# EAGLE design M705D (EAGLE 6.6.0)
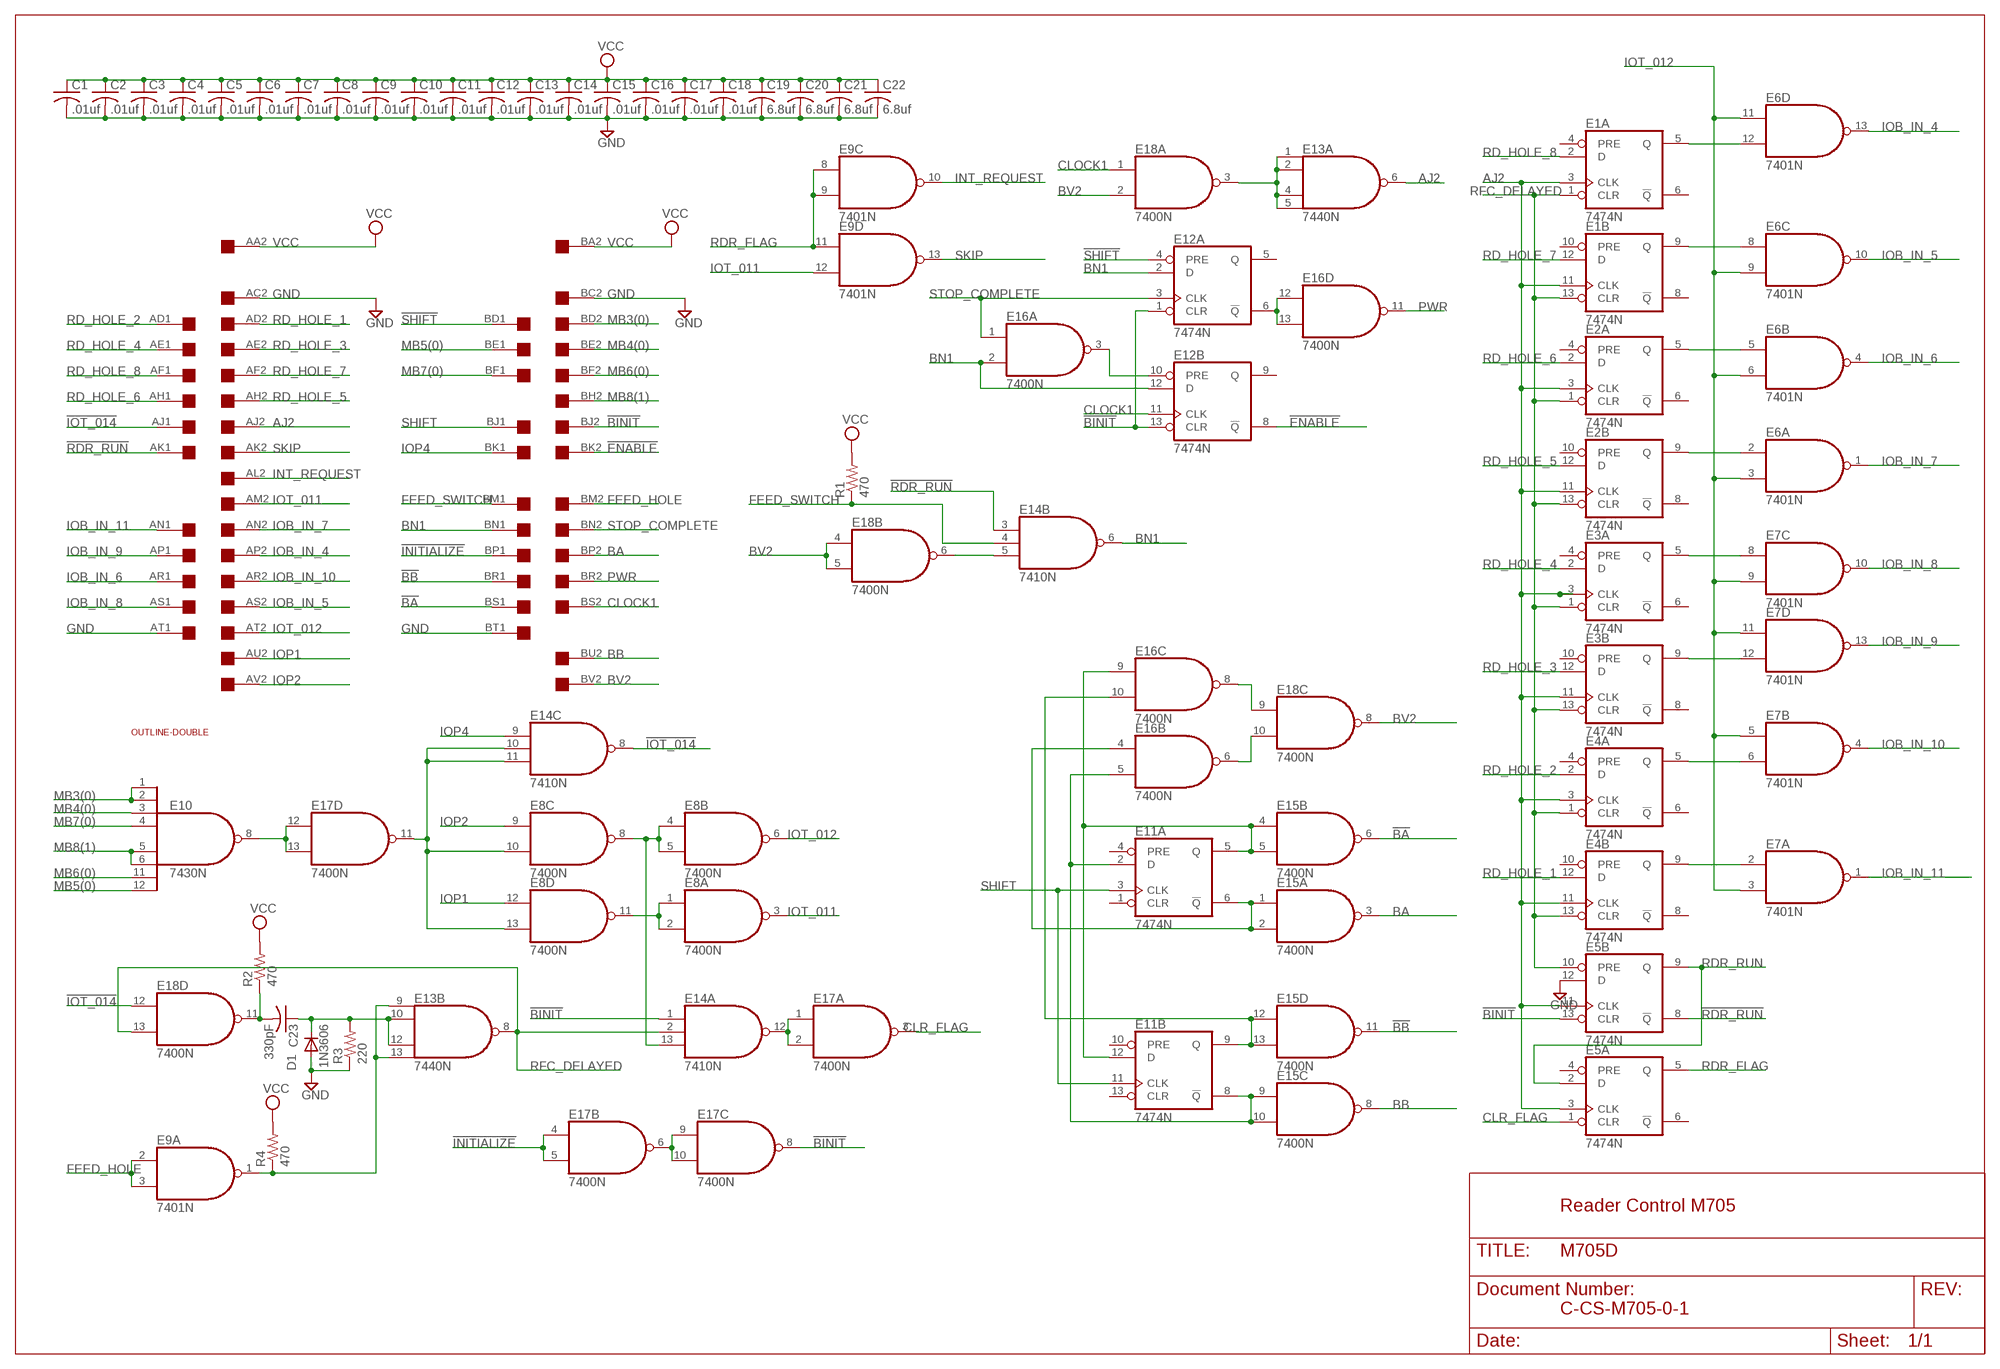
[diagram p0: schematic, sheet 1]

## Parts
C1  .01uf  C-US075-032X103  [C075-032X103]
C2  .01uf  C-US075-032X103  [C075-032X103]
C3  .01uf  C-US075-032X103  [C075-032X103]
C4  .01uf  C-US075-032X103  [C075-032X103]
C5  .01uf  C-US075-032X103  [C075-032X103]
C6  .01uf  C-US075-032X103  [C075-032X103]
C7  .01uf  C-US075-032X103  [C075-032X103]
C8  .01uf  C-US075-032X103  [C075-032X103]
C9  .01uf  C-US075-032X103  [C075-032X103]
C10  .01uf  C-US075-032X103  [C075-032X103]
C11  .01uf  C-US075-032X103  [C075-032X103]
C12  .01uf  C-US075-032X103  [C075-032X103]
C13  .01uf  C-US075-032X103  [C075-032X103]
C14  .01uf  C-US075-032X103  [C075-032X103]
C15  .01uf  C-US075-032X103  [C075-032X103]
C16  .01uf  C-US075-032X103  [C075-032X103]
C17  .01uf  C-US075-032X103  [C075-032X103]
C18  .01uf  C-US075-032X103  [C075-032X103]
C19  6.8uf  C-US150-054X183  [C150-054X183]
C20  6.8uf  C-US150-054X183  [C150-054X183]
C21  6.8uf  C-US150-054X183  [C150-054X183]
C22  6.8uf  C-US150-054X183  [C150-054X183]
C23  330pF  C-US075-032X103  [C075-032X103]
D1  1N3606  1N4148DO35-10  [DO35-10]
E1  7474N  74S74N  [DIL14]
E2  7474N  74S74N  [DIL14]
E3  7474N  74S74N  [DIL14]
E4  7474N  74S74N  [DIL14]
E5  7474N  74S74N  [DIL14]
E6  7401N  74LS01N  [DIL14]
E7  7401N  74LS01N  [DIL14]
E8  7400N  [DIL14]
E9  7401N  74LS01N  [DIL14]
E10  7430N  [DIL14]
E11  7474N  74S74N  [DIL14]
E12  7474N  74S74N  [DIL14]
E13  7440N  74S20N  [DIL14]
E14  7410N  [DIL14]
E15  7400N  [DIL14]
E16  7400N  [DIL14]
E17  7400N  [DIL14]
E18  7400N  [DIL14]
R1  470  R-US_0207/10  [0207/10]
R2  470  R-US_0207/10  [0207/10]
R3  220  R-US_0207/10  [0207/10]
R4  470  R-US_0207/10  [0207/10]
U$5  DOUBLE  [EDGE-CON4]
U$6  OUTLINE-DOUBLE  [DOUBLE]

## Nets
!BA: E15.6(B:O) U$5.BS1
!BB: E15.11(D:O) U$5.BR1
!BINIT: E5.13(B:CLR) E12.1(A:CLR) E12.13(B:CLR) E14.1(A:I0) E17.8(C:O) U$5.BJ2
!ENABLE: E12.8(B:!Q) U$5.BK2
!INITIALIZE: E17.4(B:I0) E17.5(B:I1) U$5.BP1
!IOT_014: E14.8(C:O) E18.12(D:I0) U$5.AJ1
!RDR_RUN: E5.8(B:!Q) E14.3(B:I0) U$5.AK1
!SHIFT: E12.4(A:PRE) U$5.BD1
AJ2: E1.3(A:CLK) E1.11(B:CLK) E2.3(A:CLK) E2.11(B:CLK) E3.3(A:CLK) E3.11(B:CLK) E4.3(A:CLK) E4.11(B:CLK) E5.3(A:CLK) E5.11(B:CLK) E13.6(A:O) U$5.AJ2
BA: E15.3(A:O) U$5.BP2
BB: E15.8(C:O) U$5.BU2
BN1: E12.2(A:D) E12.12(B:D) E14.6(B:O) E16.2(A:I1) U$5.BN1
BV2: E18.2(A:I1) E18.4(B:I0) E18.5(B:I1) E18.8(C:O) U$5.BV2
CLOCK1: E12.11(B:CLK) E18.1(A:I0) U$5.BS2
CLR_FLAG: E5.1(A:CLR) E17.3(A:O)
FEED_HOLE: E9.2(A:I0) E9.3(A:I1) U$5.BM2
FEED_SWITCH: E14.4(B:I1) R1.1 U$5.BM1
GND [Supply]: C1.2 C2.2 C3.2 C4.2 C5.2 C6.2 C7.2 C8.2 C9.2 C10.2 C11.2 C12.2 C13.2 C14.2 C15.2 C16.2 C17.2 C18.2 C19.2 C20.2 C21.2 C22.2 D1.A E5.12(B:D) R3.1 U$5.AC2 U$5.AT1 U$5.BC2 U$5.BT1
INT_REQUEST: E9.10(C:O) U$5.AL2
IOB_IN_4: E6.13(D:O) U$5.AP2
IOB_IN_5: E6.10(C:O) U$5.AS2
IOB_IN_6: E6.4(B:O) U$5.AR1
IOB_IN_7: E6.1(A:O) U$5.AN2
IOB_IN_8: E7.10(C:O) U$5.AS1
IOB_IN_9: E7.13(D:O) U$5.AP1
IOB_IN_10: E7.4(B:O) U$5.AR2
IOB_IN_11: E7.1(A:O) U$5.AN1
IOP1: E8.12(D:I0) U$5.AU2
IOP2: E8.9(C:I0) U$5.AV2
IOP4: E14.9(C:I0) U$5.BK1
IOT_011: E8.3(A:O) E9.12(D:I1) U$5.AM2
IOT_012: E6.3(A:I1) E6.6(B:I1) E6.9(C:I1) E6.11(D:I0) E7.3(A:I1) E7.5(B:I0) E7.9(C:I1) E7.11(D:I0) E8.6(B:O) U$5.AT2
MB3(0): E10.1(I0) E10.2(I1) U$5.BD2
MB4(0): E10.3(I2) U$5.BE2
MB5(0): E10.12(I7) U$5.BE1
MB6(0): E10.11(I6) U$5.BF2
MB7(0): E10.4(I3) U$5.BF1
MB8(1): E10.5(I4) E10.6(I5) U$5.BH2
N$1: E11.9(B:Q) E15.12(D:I0) E15.13(D:I1) E16.10(C:I1)
N$2: E1.5(A:Q) E6.12(D:I1)
N$3: E1.9(B:Q) E6.8(C:I0)
N$4: E11.6(A:!Q) E15.1(A:I0) E15.2(A:I1) E16.4(B:I0)
N$5: E10.8(O) E17.12(D:I0) E17.13(D:I1)
N$6: E8.4(B:I0) E8.5(B:I1) E8.8(C:O) E14.13(A:I2)
N$7: E8.1(A:I0) E8.2(A:I1) E8.11(D:O)
N$8: E8.10(C:I1) E8.13(D:I1) E14.10(C:I1) E14.11(C:I2) E17.11(D:O)
N$9: E2.5(A:Q) E6.5(B:I0)
N$10: E2.9(B:Q) E6.2(A:I0)
N$11: E3.5(A:Q) E7.8(C:I0)
N$12: E3.9(B:Q) E7.12(D:I1)
N$13: E4.5(A:Q) E7.6(B:I1)
N$14: E4.9(B:Q) E7.2(A:I0)
N$15: E11.2(A:D) E11.8(B:!Q) E15.9(C:I0) E15.10(C:I1) E16.5(B:I1)
N$23: E11.5(A:Q) E11.12(B:D) E15.4(B:I0) E15.5(B:I1) E16.9(C:I0)
N$24: E16.8(C:O) E18.9(C:I0)
N$25: E16.6(B:O) E18.10(C:I1)
N$26: E13.1(A:I0) E13.2(A:I1) E13.4(A:I2) E13.5(A:I3) E18.3(A:O)
N$27: E12.6(A:!Q) E16.12(D:I0) E16.13(D:I1)
N$28: E12.10(B:PRE) E16.3(A:O)
N$29: C23.2 E18.11(D:O) R2.1
N$30: C23.1 D1.C E13.10(B:I1) E13.12(B:I2) R3.2
N$31: E9.1(A:O) E13.9(B:I0) E13.13(B:I3) R4.1
N$32: E17.6(B:O) E17.9(C:I0) E17.10(C:I1)
N$33: E14.12(A:O) E17.1(A:I0) E17.2(A:I1)
N$34: E14.5(B:I2) E18.6(B:O)
PWR: E16.11(D:O) U$5.BR2
RD_HOLE_1: E4.12(B:D) U$5.AD2
RD_HOLE_2: E4.2(A:D) U$5.AD1
RD_HOLE_3: E3.12(B:D) U$5.AE2
RD_HOLE_4: E3.2(A:D) U$5.AE1
RD_HOLE_5: E2.12(B:D) U$5.AH2
RD_HOLE_6: E2.2(A:D) U$5.AH1
RD_HOLE_7: E1.12(B:D) U$5.AF2
RD_HOLE_8: E1.2(A:D) U$5.AF1
RDR_FLAG: E5.5(A:Q) E9.8(C:I0) E9.9(C:I1) E9.11(D:I0)
RDR_RUN: E5.2(A:D) E5.9(B:Q)
RFC_DELAYED: E1.1(A:CLR) E1.13(B:CLR) E2.1(A:CLR) E2.13(B:CLR) E3.1(A:CLR) E3.13(B:CLR) E4.1(A:CLR) E4.13(B:CLR) E5.10(B:PRE) E13.8(B:O) E14.2(A:I1) E18.13(D:I1)
SHIFT: E11.3(A:CLK) E11.11(B:CLK) U$5.BJ1
SKIP: E9.13(D:O) U$5.AK2
STOP_COMPLETE: E12.3(A:CLK) E16.1(A:I0) U$5.BN2
VCC [Supply]: C1.1 C2.1 C3.1 C4.1 C5.1 C6.1 C7.1 C8.1 C9.1 C10.1 C11.1 C12.1 C13.1 C14.1 C15.1 C16.1 C17.1 C18.1 C19.1 C20.1 C21.1 C22.1 R1.2 R2.2 R4.2 U$5.AA2 U$5.BA2
Unconnected: E1.4(A:PRE) E1.6(A:!Q) E1.8(B:!Q) E1.10(B:PRE) E2.4(A:PRE) E2.6(A:!Q) E2.8(B:!Q) E2.10(B:PRE) E3.4(A:PRE) E3.6(A:!Q) E3.8(B:!Q) E3.10(B:PRE) E4.4(A:PRE) E4.6(A:!Q) E4.8(B:!Q) E4.10(B:PRE) E5.4(A:PRE) E5.6(A:!Q) E9.4(B:O) E9.5(B:I0) E9.6(B:I1) E11.1(A:CLR) E11.4(A:PRE) E11.10(B:PRE) E11.13(B:CLR) E12.5(A:Q) E12.9(B:Q) U$5.AA1 U$5.AB1 U$5.AB2 U$5.AC1 U$5.AL1 U$5.AM1 U$5.AU1 U$5.AV1 U$5.BA1 U$5.BB1 U$5.BB2 U$5.BC1 U$5.BH1 U$5.BL1 U$5.BL2 U$5.BT2 U$5.BU1 U$5.BV1

## Notes on the sheet
- Reader Control M705
- C-CS-M705-0-1

## Power pins joined to a net without a drawn wire
GND: E1.7(P:GND) E2.7(P:GND) E3.7(P:GND) E4.7(P:GND) E5.7(P:GND) E6.7(P:GND) E7.7(P:GND) E8.7(P:GND) E9.7(P:GND) E10.7(GND) E11.7(P:GND) E12.7(P:GND) E13.7(P:GND) E14.7(P:GND) E15.7(P:GND) E16.7(P:GND) E17.7(P:GND) E18.7(P:GND)
VCC: E1.14(P:VCC) E2.14(P:VCC) E3.14(P:VCC) E4.14(P:VCC) E5.14(P:VCC) E6.14(P:VCC) E7.14(P:VCC) E8.14(P:VCC) E9.14(P:VCC) E10.14(VCC) E11.14(P:VCC) E12.14(P:VCC) E13.14(P:VCC) E14.14(P:VCC) E15.14(P:VCC) E16.14(P:VCC) E17.14(P:VCC) E18.14(P:VCC)

## Library data of the parts
C1-C23 = rcl:C-US: CAPACITOR, American symbol
D1 = diode:1N4148: DIODE high speed (Philips)
E1-E5 E11 E12 = 74xx-us:74*74: Dual D type positive edge triggered FLIP FLOP, preset and clear
E6 E7 E9 = 74xx-us:74*01: Quad 2-input NAND gate, open collector
E8 E15-E18 = 74xx-us:74*00: Quad 2-input NAND gate
E10 = 74xx-us:74*30: 8-input NAND gate
E13 = 74xx-us:74*20: Dual 4-input NAND gate
E14 = 74xx-us:74*10: Triple 3-input NAND gate
R1-R4 = rcl:R-US_: RESISTOR, American symbol
U$5 = dec-con:DOUBLE: Double-Height DEC board
U$6 = dec-con:OUTLINE-*: Board outlines for DEC boards.

## Net classes
1 Supply: width 0.813 mm

## Board
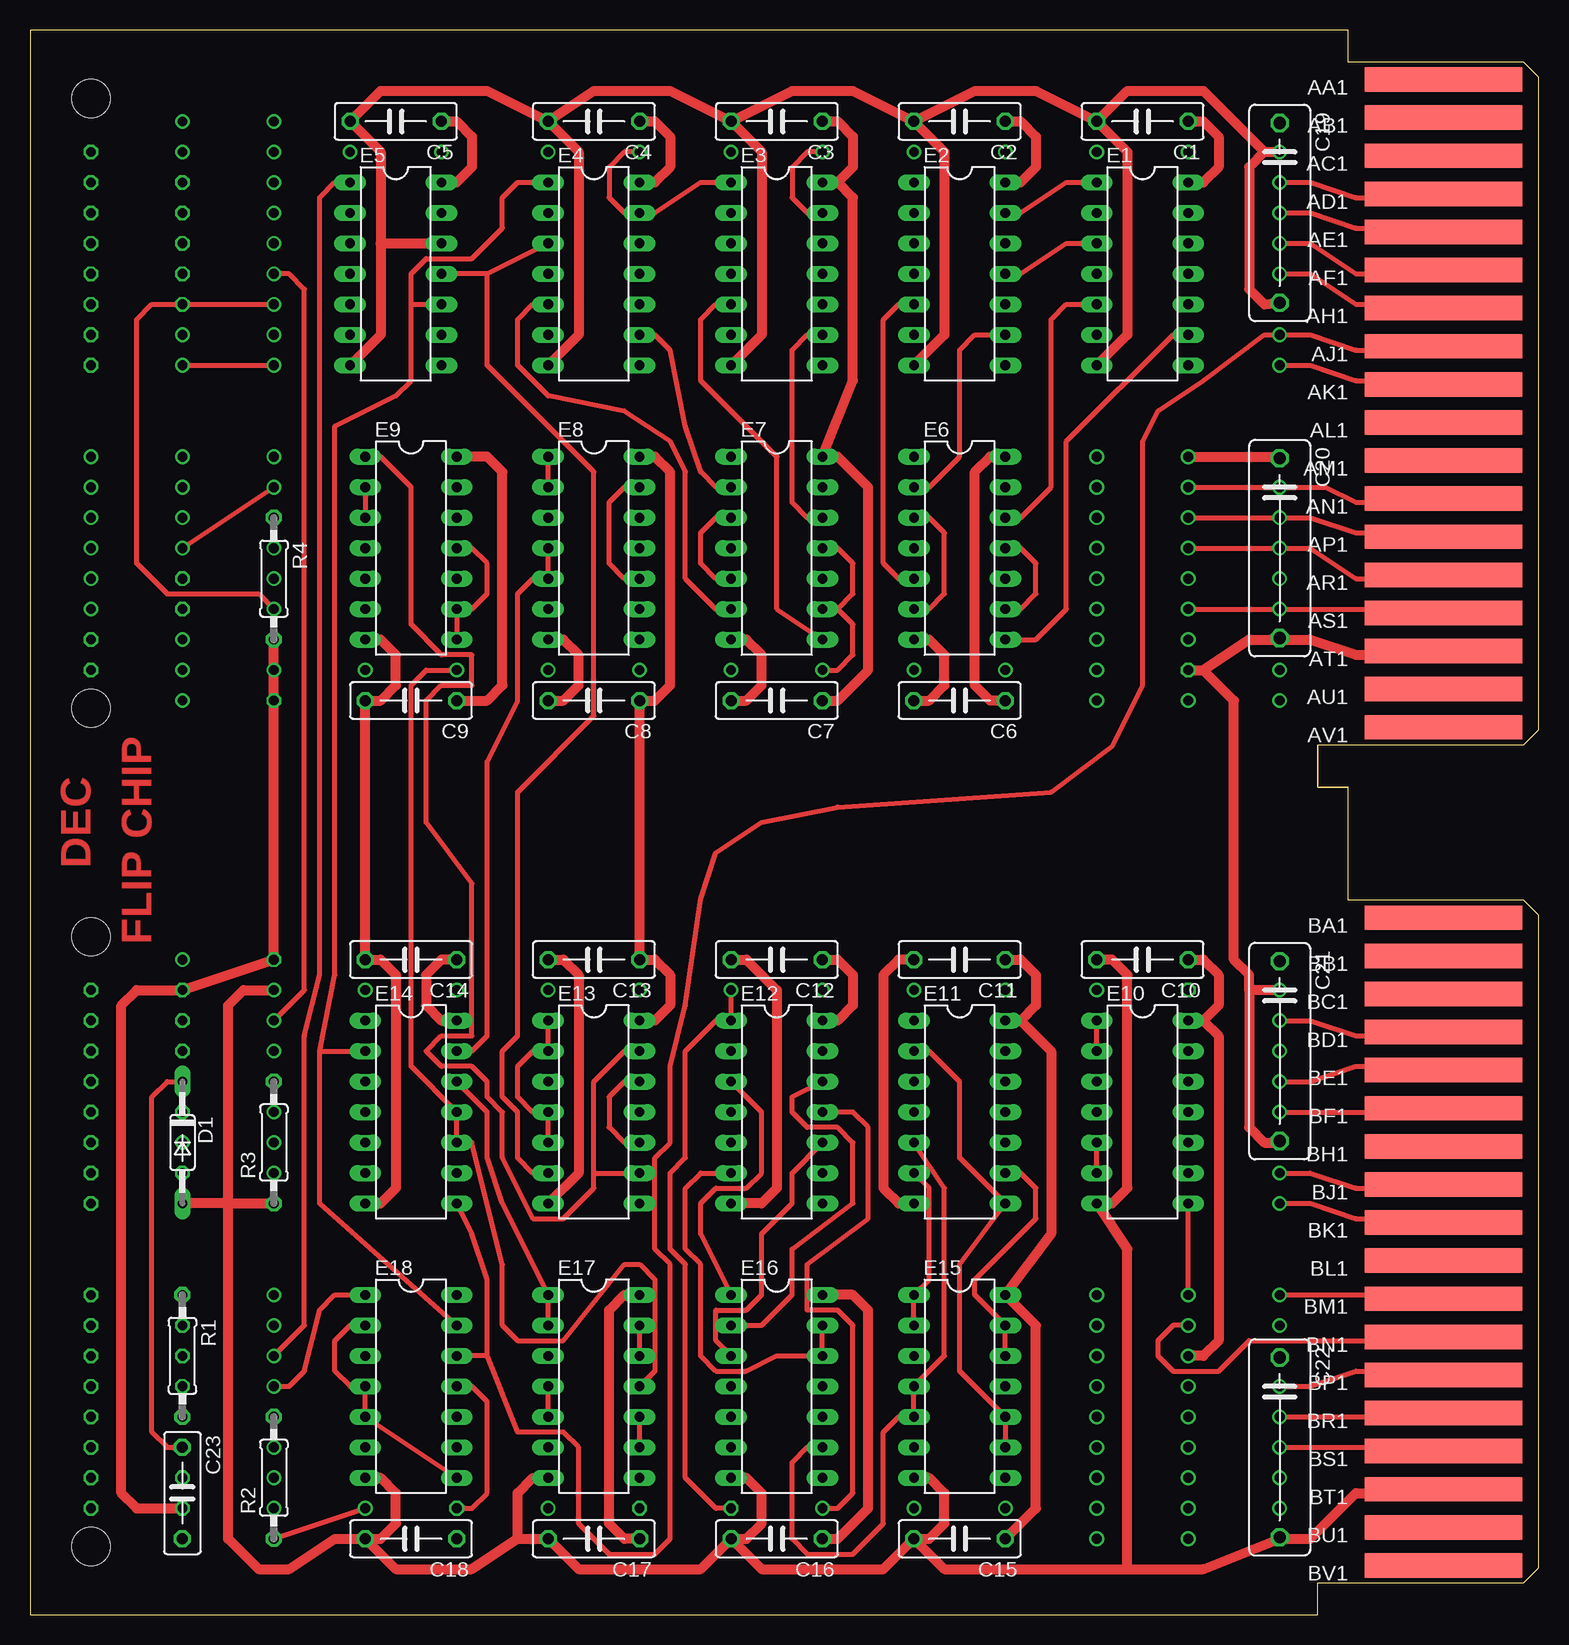
[diagram p1: board, top side]
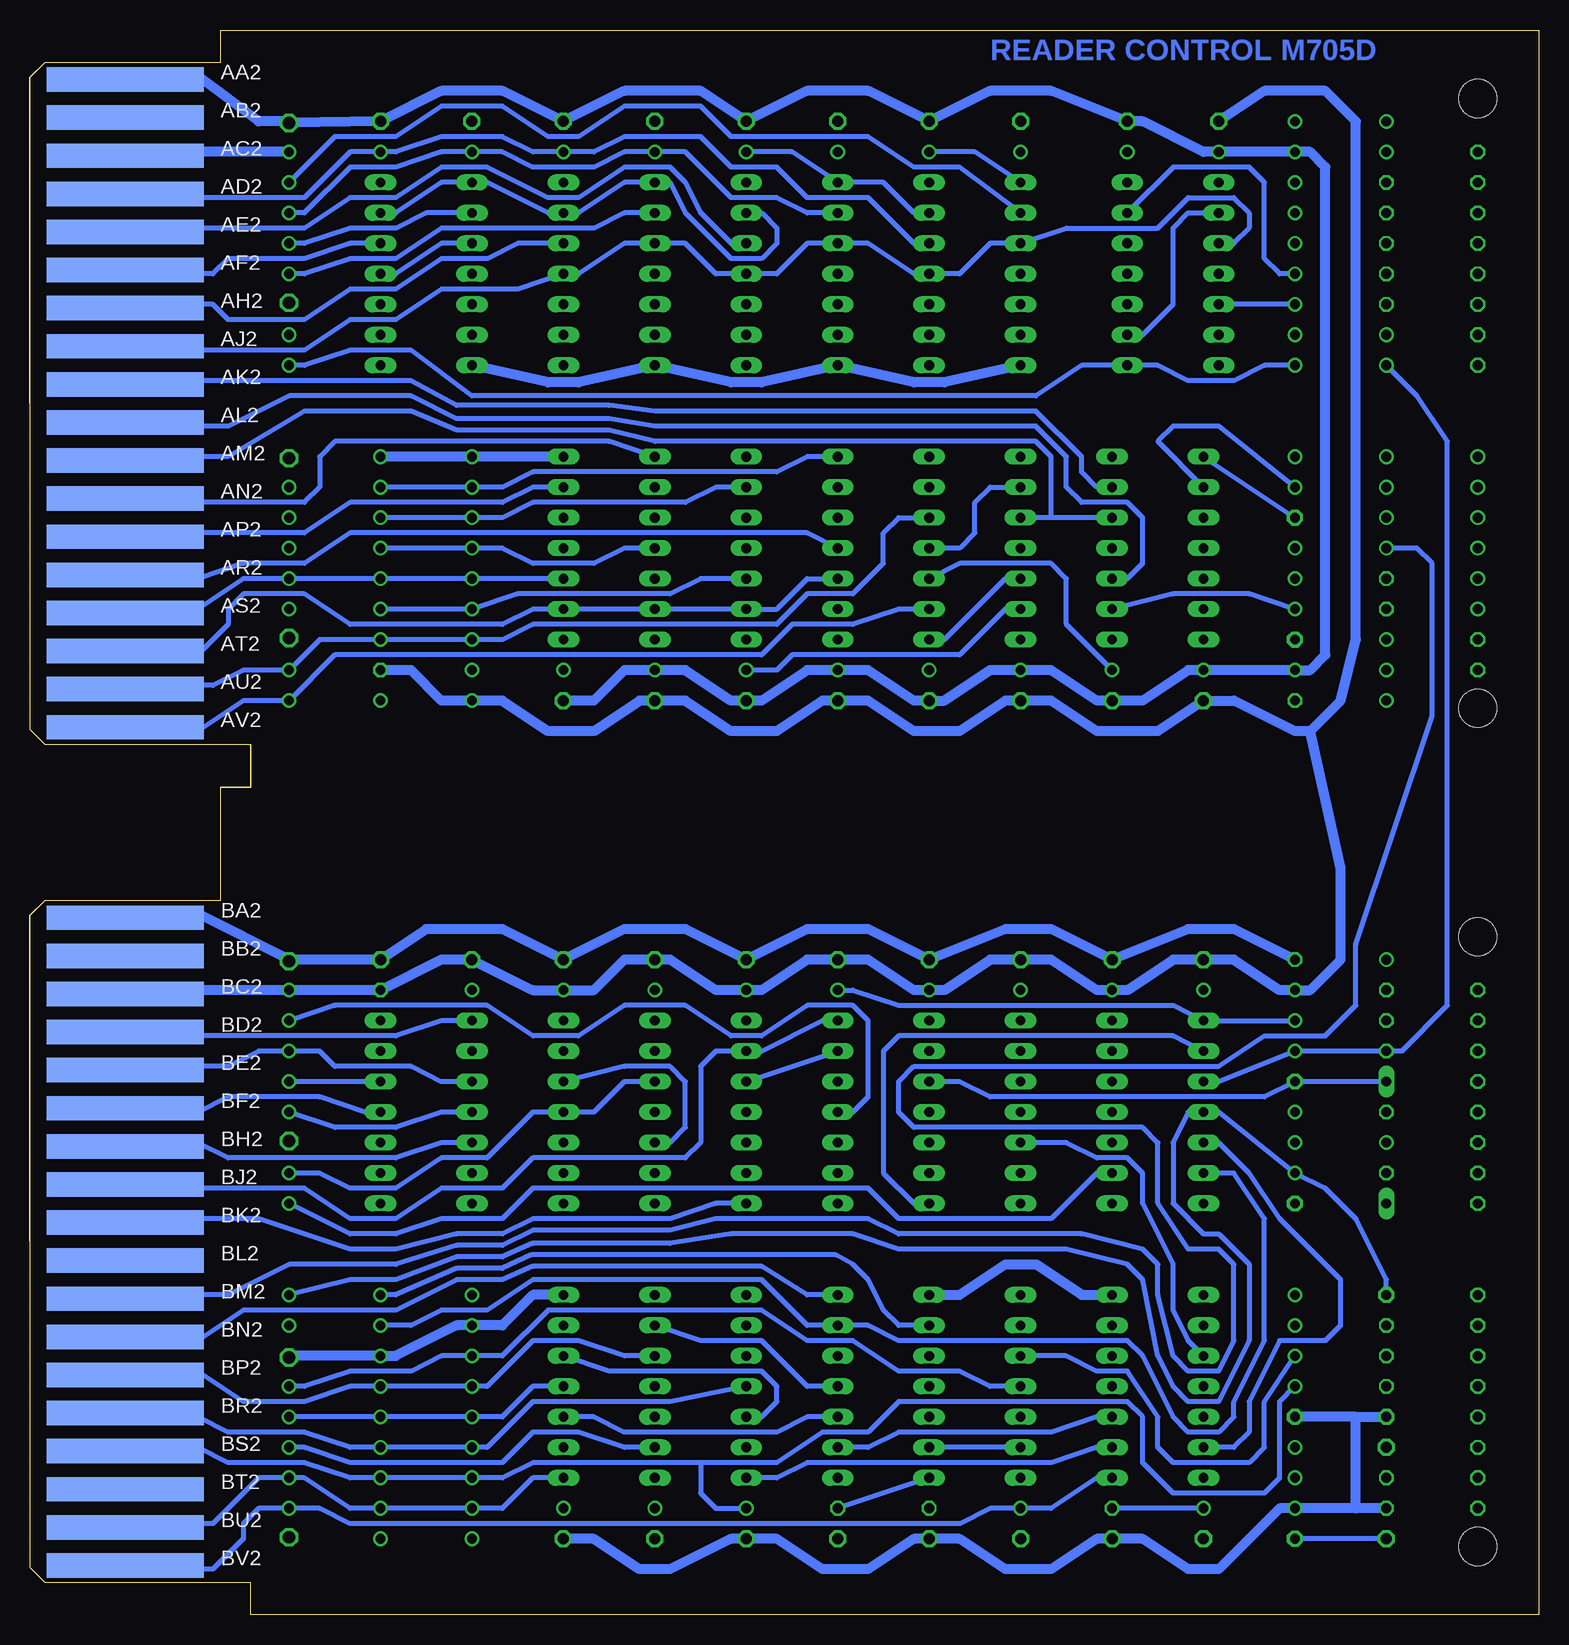
[diagram p2: board, bottom side, seen from below]

Size 125.73 x 132.08 mm. Coordinates in mm from the lower left corner, seen from the top.
Copper layers (1+16): Top 0.035mm / dielectric 1.5mm / Bottom 0.035mm
Design rules "16mils": minimum track width 16mil, minimum drill 32mil, track to track 15mil, track to pad 10mil, pad to pad 10mil, via to via 10mil, smd to smd 10mil, copper to edge 13mil, drill to drill 10mil, minimum pad ring 10mil, minimum via ring 8mil, stop-mask expansion 0mil, vias tented up to drill 0mil, thermal gap 10mil

### Footprints (pad centres in the part's own frame; a part is rotated, then mirrored left to right if it is on the bottom)
C075-032X103 = drill 0.914 octagon: 1 -3.81,0; 2 3.81,0
C150-054X183 = drill 1.016 octagon: 1 -7.493,0; 2 7.493,0
DO35-10 = drill 0.813 long: A 5.08,0; C -5.08,0
DIL14 = drill 0.813 long: 1 -7.62,-3.81; 2 -5.08,-3.81; 3 -2.54,-3.81; 4 0,-3.81; 5 2.54,-3.81; 6 5.08,-3.81; 7 7.62,-3.81; 8 7.62,3.81; 9 5.08,3.81; 10 2.54,3.81; 11 0,3.81; 12 -2.54,3.81; 13 -5.08,3.81; 14 -7.62,3.81
0207/10 = drill 0.813 octagon: 1 -5.08,0; 2 5.08,0
EDGE-CON4 = smd 13.106 x 2.032: AA1 7.938,4.128; AB1 7.938,7.303; AC1 7.938,10.477; AD1 7.938,13.652; AE1 7.938,16.828; AF1 7.938,20.003; AH1 7.938,23.177; AJ1 7.938,26.352; AK1 7.938,29.527; AL1 7.938,32.703; AM1 7.938,35.877; AN1 7.938,39.053; AP1 7.938,42.227; AR1 7.938,45.403; AS1 7.938,48.578; AT1 7.938,51.752; AU1 7.938,54.928; AV1 7.938,58.102; BA1 7.938,73.978; BB1 7.938,77.153; BC1 7.938,80.328; BD1 7.938,83.502; BE1 7.938,86.677; BF1 7.938,89.853; BH1 7.938,93.028; BJ1 7.938,96.203; BK1 7.938,99.377; BL1 7.938,102.552; BM1 7.938,105.728; BN1 7.938,108.903; BP1 7.938,112.078; BR1 7.938,115.252; BS1 7.938,118.427; BT1 7.938,121.603; BU1 7.938,124.778; BV1 7.938,127.953 | smd 13.106 x 2.032 bottom: AA2 7.938,4.128; AB2 7.938,7.303; AC2 7.938,10.477; AD2 7.938,13.652; AE2 7.938,16.828; AF2 7.938,20.003; AH2 7.938,23.177; AJ2 7.938,26.352; AK2 7.938,29.527; AL2 7.938,32.703; AM2 7.938,35.877; AN2 7.938,39.053; AP2 7.938,42.227; AR2 7.938,45.403; AS2 7.938,48.578; AT2 7.938,51.752; AU2 7.938,54.928; AV2 7.938,58.102; BA2 7.938,73.978; BB2 7.938,77.153; BC2 7.938,80.328; BD2 7.938,83.502; BE2 7.938,86.677; BF2 7.938,89.853; BH2 7.938,93.028; BJ2 7.938,96.203; BK2 7.938,99.377; BL2 7.938,102.552; BM2 7.938,105.728; BN2 7.938,108.903; BP2 7.938,112.078; BR2 7.938,115.252; BS2 7.938,118.427; BT2 7.938,121.603; BU2 7.938,124.778; BV2 7.938,127.953
DOUBLE = hole 3.175: 120.65,56.515; 120.65,5.715; 120.65,75.565; 120.65,126.365

### Placement (x,y rotation side)
C1  92.71,124.46 180 top
C2  77.47,124.46 180 top
C3  62.23,124.46 180 top
C4  46.99,124.46 180 top
C5  30.48,124.46 180 top
C6  77.47,76.2 180 top
C7  62.23,76.2 180 top
C8  46.99,76.2 180 top
C9  31.75,76.2 180 top
C10  92.71,54.61 180 top
C11  77.47,54.61 180 top
C12  62.23,54.61 180 top
C13  46.99,54.61 180 top
C14  31.75,54.61 180 top
C15  77.47,6.35 180 top
C16  62.23,6.35 180 top
C17  46.99,6.35 180 top
C18  31.75,6.35 180 top
C19  104.14,116.84 270 top
C20  104.14,88.9 270 top
C21  104.14,46.99 270 top
C22  104.14,13.97 270 top
C23  12.7,10.16 270 top
D1  12.7,39.37 270 top
E1  92.71,111.76 270 top
E2  77.47,111.76 270 top
E3  62.23,111.76 270 top
E4  46.99,111.76 270 top
E5  30.48,111.76 270 top
E6  77.47,88.9 270 top
E7  62.23,88.9 270 top
E8  46.99,88.9 270 top
E9  31.75,88.9 270 top
E10  92.71,41.91 270 top
E11  77.47,41.91 270 top
E12  62.23,41.91 270 top
E13  46.99,41.91 270 top
E14  31.75,41.91 270 top
E15  77.47,19.05 270 top
E16  62.23,19.05 270 top
E17  46.99,19.05 270 top
E18  31.75,19.05 270 top
R1  12.7,21.59 270 top
R2  20.32,11.43 90 top
R3  20.32,39.37 90 top
R4  20.32,86.36 270 top
U$3  [FLIPCHIP]  5.08,36.83 0 top
U$5  125.73,132.08 180 top
U$6  125.73,132.08 180 top

### Tracks (layer width: path | path; a pad name or v marks a point on that pad's centre or on a via)
!BA  (via drill 0.81)
  Top 0.406: U$5.BS1 116.84,13.97 v104.14,13.97
  Bottom 0.406: v104.14,13.97 102.87,13.97 99.06,12.7 86.36,12.7 83.82,15.24 80.01,15.24 76.2,13.97 E15.6
!BB  (via drill 0.81)
  Top 0.406: U$5.BR1 116.84,16.51 v104.14,16.51
  Bottom 0.406: v104.14,16.51 v96.52,16.51 v88.9,16.51 86.36,16.51 83.82,19.05 E15.11
!BINIT  (via drill 0.81)
  Top 0.406: v58.42,8.89 57.15,8.89 54.61,11.43 54.61,29.21 53.34,30.48 53.34,36.83 54.61,38.1 54.61,46.99 57.15,49.53 E12.1 v58.42,52.07 | v20.32,49.53 22.86,52.07 22.86,110.49 21.59,111.76 v20.32,111.76
  Bottom 0.406: E12.1 59.69,49.53 64.77,46.99 E12.13 68.58,46.99 69.85,45.72 69.85,39.37 71.12,38.1 83.82,38.1 86.36,35.56 91.44,35.56 95.25,33.02 99.06,33.02 102.87,35.56 116.84,35.56 U$5.BJ2 | v58.42,52.07 57.15,52.07 53.34,50.8 30.48,50.8 E14.1 v20.32,49.53 | E17.8 v58.42,8.89 | v20.32,111.76 21.59,111.76 22.86,113.03 22.86,119.38 24.13,120.65 30.48,120.65 E5.13
!ENABLE
  Bottom 0.406: U$5.BK2 116.84,33.02 106.68,33.02 99.06,30.48 95.25,30.48 90.17,31.75 86.36,31.75 83.82,33.02 72.39,33.02 68.58,34.29 E12.8
!INITIALIZE  (via drill 0.81)
  Top 0.406: U$5.BP1 116.84,20.32 110.49,20.32 106.68,19.05 v104.14,19.05 | E17.5 E17.4
  Bottom 0.406: v104.14,19.05 102.87,19.05 99.06,20.32 93.98,20.32 91.44,21.59 v88.9,21.59 86.36,21.59 82.55,25.4 64.77,25.4 60.96,22.86 57.15,22.86 53.34,20.32 48.26,20.32 45.72,19.05 E17.4
!IOT_014  (via drill 0.81)
  Top 0.406: E14.8 36.83,31.75 38.1,27.94 38.1,21.59 | 38.1,21.59 E18.12 | U$5.AJ1 116.84,105.41 110.49,105.41 106.68,106.68 v104.14,106.68 102.87,106.68 97.79,102.87 93.98,100.33 92.71,97.79 92.71,77.47 90.17,72.39 85.09,68.58 67.31,67.31 60.96,66.04 57.15,63.5 55.88,59.69 54.61,50.8 53.34,45.72 53.34,39.37 52.07,38.1 52.07,30.48 53.34,29.21 53.34,6.35 52.07,5.08 48.26,5.08 45.72,7.62 45.72,13.97 44.45,15.24 40.64,15.24 38.1,21.59
!RDR_RUN  (via drill 0.81)
  Top 0.406: U$5.AK1 116.84,102.87 110.49,102.87 106.68,104.14 v104.14,104.14 | v12.7,104.14 v20.32,104.14
  Bottom 0.406: E14.3 26.67,44.45 v20.32,46.99 v12.7,46.99 11.43,46.99 7.62,50.8 7.62,97.79 10.16,101.6 v12.7,104.14 | v104.14,104.14 102.87,104.14 99.06,105.41 93.98,105.41 88.9,101.6 41.91,101.6 38.1,104.14 E5.8 31.75,104.14 29.21,102.87 25.4,102.87 22.86,104.14 v20.32,104.14
!SHIFT  (via drill 0.81)
  Top 0.406: U$5.BD1 116.84,48.26 110.49,48.26 106.68,49.53 v104.14,49.53
  Bottom 0.406: v104.14,49.53 100.33,50.8 87.63,50.8 83.82,48.26 80.01,48.26 76.2,50.8 71.12,50.8 67.31,48.26 64.77,48.26 60.96,50.8 57.15,50.8 55.88,49.53 55.88,43.18 57.15,41.91 E12.4
AJ2
  Top 0.406: E2.11 82.55,111.76 86.36,114.3 E1.3 | 38.1,111.76 E5.11 | 38.1,111.76 E4.3 | 38.1,111.76 38.1,104.14 46.99,95.25 46.99,74.93 40.64,68.58 40.64,48.26 39.37,46.99 39.37,43.18 40.64,41.91 40.64,38.1 41.91,36.83 E13.6
  Bottom 0.406: U$5.AJ2 116.84,105.41 102.87,105.41 99.06,107.95 95.25,107.95 91.44,110.49 85.09,110.49 E2.11 80.01,111.76 76.2,114.3 E2.3 71.12,114.3 68.58,111.76 E3.11 63.5,111.76 60.96,114.3 E3.3 55.88,114.3 52.07,111.76 E4.11 48.26,111.76 45.72,114.3 E4.3 39.37,115.57 31.75,115.57 29.21,118.11 25.4,118.11 24.13,116.84 24.13,115.57 25.4,114.3 E5.3 | E1.11 95.25,111.76 91.44,114.3 E1.3
BA  (via drill 0.81)
  Bottom 0.406: U$5.BP2 116.84,20.32 111.76,20.32 107.95,17.78 102.87,17.78 99.06,19.05 v96.52,19.05 v88.9,19.05 87.63,19.05 83.82,22.86 80.01,22.86 76.2,21.59 E15.3
BB  (via drill 0.81)
  Bottom 0.406: U$5.BU2 116.84,7.62 110.49,7.62 106.68,11.43 v104.14,11.43 102.87,11.43 99.06,8.89 v96.52,8.89 v88.9,8.89 86.36,8.89 83.82,11.43 E15.8
BN1  (via drill 0.81)
  Top 0.406: U$5.BN1 116.84,22.86 101.6,22.86 99.06,20.32 95.25,20.32 93.98,21.59 93.98,22.86 95.25,24.13 v96.52,24.13 | E16.2 60.96,24.13 63.5,26.67 63.5,30.48 68.58,34.29 68.58,39.37 67.31,40.64 64.77,40.64 63.5,41.91 63.5,43.18 E12.12
  Bottom 0.406: E12.12 E12.2 | v96.52,24.13 93.98,24.13 91.44,25.4 87.63,25.4 83.82,27.94 64.77,27.94 60.96,24.13 E16.2 55.88,24.13 53.34,22.86 34.29,22.86 33.02,21.59 30.48,16.51 29.21,15.24 26.67,15.24 25.4,16.51 25.4,17.78 22.86,22.86 22.86,33.02 25.4,36.83 E14.6
BV2  (via drill 0.81)
  Top 0.406: E18.2 26.67,24.13 25.4,22.86 25.4,20.32 26.67,19.05 E18.4 E18.5 E18.8
  Bottom 0.406: U$5.BV2 115.57,3.81 110.49,3.81 107.95,6.35 107.95,7.62 106.68,8.89 v104.14,8.89 101.6,8.89 99.06,7.62 48.26,7.62 45.72,8.89 v43.18,8.89 40.64,8.89 36.83,11.43 E18.8
CLOCK1  (via drill 0.81)
  Top 0.406: E18.1 25.4,26.67 24.13,25.4 22.86,20.32 21.59,19.05 v20.32,19.05 | E12.11 68.58,41.91 69.85,40.64 69.85,33.02 64.77,29.21 64.77,25.4 67.31,25.4 68.58,24.13 68.58,10.16 67.31,8.89 v66.04,8.89
  Bottom 0.406: U$5.BS2 116.84,13.97 111.76,13.97 109.22,12.7 102.87,12.7 99.06,11.43 v96.52,11.43 v88.9,11.43 86.36,11.43 83.82,12.7 69.85,12.7 | 69.85,12.7 63.5,12.7 59.69,15.24 55.88,15.24 53.34,17.78 34.29,17.78 33.02,16.51 33.02,12.7 30.48,10.16 22.86,10.16 21.59,11.43 21.59,17.78 v20.32,19.05 | v66.04,8.89 68.58,8.89 69.85,10.16 69.85,12.7
CLR_FLAG  (via drill 0.81)
  Top 0.406: E5.1 25.4,119.38 24.13,118.11 24.13,53.34 22.86,48.26 22.86,24.13 v20.32,21.59
  Bottom 0.406: E17.3 39.37,21.59 36.83,20.32 34.29,20.32 31.75,16.51 31.75,13.97 30.48,12.7 24.13,12.7 22.86,13.97 22.86,17.78 v20.32,21.59
FEED_HOLE  (via drill 0.81)
  Top 0.406: E9.2 E9.3 | v12.7,88.9 v20.32,93.98
  Bottom 0.406: U$5.BM2 116.84,26.67 109.22,26.67 104.14,29.21 95.25,29.21 90.17,30.8 86.36,30.8 83.82,32.07 72.39,32.07 68.58,33.02 55.88,33.02 53.34,31.75 38.1,31.75 33.02,30.48 31.75,29.21 31.75,26.67 30.48,21.59 29.21,20.32 26.67,20.32 25.4,22.86 25.4,29.21 26.67,30.48 29.21,30.48 31.75,34.29 31.75,39.37 33.02,40.64 52.07,40.64 53.34,41.91 53.34,44.45 52.07,45.72 26.67,45.72 22.86,48.26 17.78,48.26 15.24,50.8 15.24,55.88 8.89,74.93 8.89,87.63 10.16,88.9 v12.7,88.9 | v20.32,93.98 26.67,99.06 30.48,99.06 31.75,97.79 E9.2
FEED_SWITCH  (via drill 0.81)
  Top 0.406: U$5.BM1 116.84,26.67 v104.14,26.67
  Bottom 0.406: v104.14,26.67 99.06,27.94 95.25,27.94 90.17,29.84 86.36,29.84 83.82,30.96 72.39,30.96 67.31,31.75 57.15,31.75 53.34,30.48 39.37,30.48 34.29,29.21 33.02,27.94 31.75,21.59 30.48,19.05 29.21,17.78 26.67,17.78 24.13,22.86 24.13,29.21 26.67,31.75 27.94,31.75 30.48,34.29 30.48,39.37 29.21,41.91 E14.4 26.67,41.91 v20.32,36.83 17.78,35.56 15.24,33.02 12.7,27.94 R1.1
GND  (via drill 0.81)
  Top 0.813: U$5.AT1 116.84,80.01 110.49,80.01 106.68,81.28 104.14,81.28 | 104.14,81.28 C20.2 | 104.14,81.28 101.6,81.28 97.79,78.74 | v96.52,78.74 97.79,78.74 | 97.79,78.74 100.33,76.2 100.33,54.61 101.6,53.34 101.6,52.07 | 101.6,52.07 101.6,40.64 102.87,39.37 104.14,39.37 C21.2 | v104.14,52.07 101.6,52.07 | C18.2 30.48,3.81 36.83,3.81 40.64,6.35 | 40.64,6.35 C17.2 45.72,3.81 55.88,3.81 C16.2 | E17.7 41.91,11.43 40.64,10.16 40.64,6.35 | C16.2 60.96,3.81 71.12,3.81 C15.2 | C15.2 76.2,3.81 91.44,3.81 | 91.44,3.81 97.79,3.81 104.14,6.35 | U$5.BT1 119.38,10.16 110.49,10.16 106.68,6.35 104.14,6.35 | 91.44,3.81 91.44,30.48 E10.7 90.17,34.29 91.44,35.56 91.44,53.34 90.17,54.61 C10.2 | E15.7 74.93,11.43 76.2,10.16 76.2,7.62 74.93,6.35 C15.2 | C19.2 102.87,109.22 101.6,110.49 101.6,120.65 102.87,121.92 | 102.87,121.92 97.79,127 91.44,127 C1.2 | 102.87,121.92 v104.14,121.92 | C2.2 78.74,127 83.82,127 C1.2 | C3.2 63.5,127 68.58,127 C2.2 | C4.2 46.99,127 53.34,127 C3.2 | C4.2 38.1,127 29.21,127 C5.2 29.21,121.92 29.21,114.3 | E1.7 91.44,106.68 91.44,121.92 C1.2 | E2.7 76.2,106.68 76.2,121.92 C2.2 | E3.7 60.96,106.68 60.96,121.92 C3.2 | E4.7 45.72,106.68 45.72,121.92 C4.2 | E5.7 29.21,106.68 29.21,114.3 | E18.7 29.21,11.43 30.48,10.16 30.48,7.62 29.21,6.35 C18.2 | C16.2 59.69,6.35 60.96,7.62 60.96,10.16 59.69,11.43 E16.7 | E9.7 29.21,81.28 30.48,80.01 30.48,77.47 29.21,76.2 C9.2 C14.2 29.21,54.61 30.48,53.34 30.48,35.56 29.21,34.29 E14.7 | C8.2 44.45,76.2 45.72,77.47 45.72,80.01 44.45,81.28 E8.7 | C7.2 59.69,76.2 60.96,77.47 60.96,80.01 59.69,81.28 E7.7 | C6.2 74.93,76.2 76.2,77.47 76.2,80.01 74.93,81.28 E6.7
  Top 0.813: C18.2 25.4,6.35 21.59,3.81 19.05,3.81 16.51,6.35 16.51,34.29 | 16.51,34.29 R3.1 | 16.51,34.29 D1.A | 16.51,34.29 16.51,50.8 17.78,52.07 v20.32,52.07 | C12.2 59.69,54.61 62.23,52.07 62.23,35.56 60.96,34.29 E12.7 | E11.7 72.39,34.29 71.12,35.56 71.12,53.34 72.39,54.61 C11.2 | 29.21,114.3 E5.12 | E13.7 45.72,36.83 45.72,53.34 44.45,54.61 C13.2 | 104.14,6.35 C22.2
  Bottom 0.813: U$5.BC2 116.84,52.07 v104.14,52.07 v96.52,52.07 91.44,54.61 C10.2 83.82,52.07 v81.28,52.07 78.74,52.07 76.2,54.61 C11.2 72.39,54.61 68.58,52.07 v66.04,52.07 64.77,52.07 60.96,54.61 C12.2 55.88,54.61 52.07,52.07 v50.8,52.07 49.53,52.07 45.72,54.61 C13.2 40.64,54.61 36.83,52.07 v35.56,52.07 34.29,52.07 30.48,54.61 C14.2 25.4,54.61 21.59,52.07 v20.32,52.07 19.05,52.07 16.51,54.61 16.51,62.23 19.05,73.66 | U$5.AC2 116.84,121.92 v104.14,121.92 | v96.52,78.74 93.98,78.74 91.44,76.2 v88.9,76.2 86.36,76.2 82.55,73.66 78.74,73.66 74.93,76.2 C6.2 71.12,76.2 67.31,73.66 63.5,73.66 59.69,76.2 C7.2 55.88,76.2 52.07,73.66 48.26,73.66 44.45,76.2 C8.2 40.64,76.2 36.83,73.66 31.75,73.66 C9.2 25.4,76.2 20.32,73.66 19.05,73.66 | C5.2 22.86,127 17.78,127 15.24,124.46 15.24,81.28 16.51,76.2 19.05,73.66 | E4.7 49.53,102.71 52.07,102.71 E3.7 64.77,102.71 67.31,102.71 E2.7 80.01,102.71 82.55,102.71 E1.7
INT_REQUEST
  Bottom 0.406: U$5.AL2 116.84,99.06 109.22,99.06 104.14,101.6 93.98,101.6 90.17,99.69 77.47,99.69 73.66,99.06 41.91,99.06 39.37,96.52 39.37,93.98 38.1,92.71 34.29,92.71 33.02,91.44 33.02,87.63 34.29,86.36 E9.10
IOB_IN_4
  Bottom 0.406: U$5.AP2 116.84,90.17 102.87,90.17 99.06,92.71 86.36,92.71 83.82,93.98 E6.13
IOB_IN_5  (via drill 0.81)
  Bottom 0.406: U$5.AS2 116.84,83.82 111.76,83.82 107.95,86.36 v104.14,86.36 v96.52,86.36 v88.9,86.36 E6.10
IOB_IN_6  (via drill 0.81)
  Top 0.406: U$5.AR1 116.84,86.36 110.49,86.36 106.68,88.9 v104.14,88.9 v96.52,88.9
  Bottom 0.406: v96.52,88.9 v88.9,88.9 86.36,88.9 83.82,87.63 78.74,87.63 76.2,88.9 E6.4
IOB_IN_7
  Bottom 0.406: U$5.AN2 116.84,92.71 102.87,92.71 101.6,93.98 101.6,96.52 100.33,97.79 77.47,97.79 E6.1
IOB_IN_8  (via drill 0.81)
  Top 0.406: U$5.AS1 115.57,83.82 v104.14,83.82 v96.52,83.82
  Bottom 0.406: v96.52,83.82 v88.9,83.82 85.09,85.09 72.39,85.09 69.85,86.36 E7.10
IOB_IN_9  (via drill 0.81)
  Top 0.406: U$5.AP1 115.57,90.17 110.49,90.17 106.68,91.44 v104.14,91.44 v96.52,91.44
  Bottom 0.406: v96.52,91.44 v88.9,91.44 86.36,91.44 83.82,92.71 71.12,92.71 68.58,93.98 E7.13
IOB_IN_10
  Bottom 0.406: U$5.AR2 116.84,86.36 111.76,86.36 107.95,87.63 102.87,87.63 99.06,90.17 60.96,90.17 E7.4
IOB_IN_11  (via drill 0.81)
  Top 0.406: U$5.AN1 115.57,92.71 110.49,92.71 107.95,93.98 v104.14,93.98 v96.52,93.98
  Bottom 0.406: v96.52,93.98 v88.9,93.98 86.36,93.98 83.82,95.25 63.5,95.25 60.96,96.52 E7.1
IOP1  (via drill 0.81)
  Bottom 0.406: U$5.AU2 116.84,77.47 110.49,77.47 107.95,78.74 v104.14,78.74 101.6,81.28 v96.52,81.28 v88.9,81.28 86.36,81.28 83.82,82.55 63.5,82.55 60.96,85.09 57.15,85.09 54.61,87.63 54.61,90.17 53.34,91.44 E8.12
IOP2  (via drill 0.81)
  Bottom 0.406: U$5.AV2 116.84,73.66 111.76,73.66 107.95,76.2 v104.14,76.2 100.33,80.01 64.77,80.01 62.23,82.55 57.15,82.55 53.34,83.82 E8.9
IOP4  (via drill 0.81)
  Top 0.406: U$5.BK1 116.84,33.02 110.49,33.02 106.68,34.29 v104.14,34.29
  Bottom 0.406: v104.14,34.29 99.06,31.75 95.25,31.75 91.44,33.02 86.36,33.02 83.82,35.56 55.88,35.56 53.34,33.02 40.64,33.02 36.83,36.83 E14.9
IOT_011
  Bottom 0.406: U$5.AM2 116.84,96.52 109.22,96.52 102.87,100.33 93.98,100.33 90.17,98.74 77.47,98.74 73.66,97.79 41.91,97.79 40.64,96.52 40.64,91.44 | E9.12 40.64,91.44 | 40.64,91.44 E8.3
IOT_012  (via drill 0.81)
  Top 0.406: E6.9 82.55,83.82 83.82,85.09 83.82,87.63 82.55,88.9 E6.11 | E7.11 67.31,88.9 68.58,87.63 68.58,85.09 67.31,83.82 | 67.31,83.82 E7.9 | 67.31,83.82 68.58,82.55 68.58,80.01 67.31,78.74 v66.04,78.74 | E7.5 57.15,86.36 55.88,87.63 55.88,90.17 57.15,91.44 E7.3 | E6.3 74.93,91.44 76.2,90.17 76.2,85.09 74.93,83.82 E6.6
  Bottom 0.406: U$5.AT2 116.84,80.01 111.76,80.01 109.22,82.55 109.22,83.82 107.95,85.09 102.87,85.09 99.06,82.55 86.36,82.55 83.82,83.82 E6.9 E6.6 E7.9 63.5,83.82 60.96,86.36 E7.5 | E8.6 44.45,83.82 48.26,80.01 62.23,80.01 63.5,78.74 v66.04,78.74
MB3(0)
  Top 0.406: E10.2 E10.1
  Bottom 0.406: U$5.BD2 116.84,48.26 95.25,48.26 91.44,49.53 E10.1
MB4(0)  (via drill 0.81)
  Bottom 0.406: E10.3 91.44,44.45 93.98,45.72 100.33,45.72 101.6,46.99 v104.14,46.99 106.68,46.99 109.22,45.72 116.84,45.72 U$5.BE2
MB5(0)  (via drill 0.81)
  Top 0.406: U$5.BE1 116.84,45.72 110.49,45.72 106.68,44.45 v104.14,44.45
  Bottom 0.406: E10.12 v104.14,44.45
MB6(0)
  Bottom 0.406: E10.11 97.79,41.91 101.6,43.18 109.22,43.18 111.76,41.91 116.84,41.91 U$5.BF2
MB7(0)  (via drill 0.81)
  Top 0.406: U$5.BF1 116.84,41.91 v104.14,41.91
  Bottom 0.406: E10.4 91.44,41.91 95.25,40.64 100.33,40.64 v104.14,41.91
MB8(1)
  Top 0.406: E10.6 E10.5
  Bottom 0.406: U$5.BH2 116.84,39.37 111.76,39.37 109.22,38.1 95.25,38.1 91.44,39.37 E10.5
N$1
  Top 0.406: E15.12 E15.13 78.74,26.67 78.74,27.94 83.82,33.02 83.82,35.56 82.55,36.83 E11.9
  Bottom 0.406: E15.12 77.47,20.32 64.77,20.32 63.5,19.05 63.5,17.78 64.77,16.51 E16.10
N$2
  Top 0.406: E6.12 82.55,91.44 85.09,93.98 85.09,107.95 86.36,109.22 E1.5
N$3
  Top 0.406: E6.8 83.82,81.28 86.36,83.82 86.36,97.79 95.25,106.68 E1.9
N$4
  Top 0.406: E15.2 E15.1 74.93,27.94 74.93,35.56 E11.6
  Bottom 0.406: E16.4 60.96,19.05 64.77,22.86 69.85,22.86 E15.2
N$5  (via drill 0.81)
  Top 0.406: E17.12 E17.13 | v96.52,26.67 E10.8
  Bottom 0.406: v96.52,26.67 95.25,26.67 90.17,28.89 86.36,28.89 83.98,30 58.58,30 57.15,29.21 55.88,27.94 54.61,25.4 53.34,24.13 E17.13
N$6
  Top 0.406: E8.4 E8.5 41.91,86.36 40.64,85.09 40.64,76.2 38.1,71.12 38.1,48.26 36.83,46.99 E14.13
  Bottom 0.406: E8.5 44.45,86.36 49.53,81.28 E8.8
N$7
  Top 0.406: E8.2 E8.1
  Bottom 0.406: E8.2 45.72,93.98 46.99,92.71 46.99,90.17 48.26,88.9 E8.11
N$8  (via drill 0.81)
  Top 0.406: E17.11 52.07,20.32 52.07,27.94 50.8,29.21 49.53,29.21 44.45,22.86 40.64,22.86 39.37,24.13 39.37,29.21 36.83,39.37 E14.10 E14.11 31.75,45.72 31.75,77.47 33.02,78.74 v35.56,78.74 | E8.13 49.53,93.98 48.26,92.71 48.26,87.63 49.53,86.36 E8.10
  Bottom 0.406: E8.10 48.26,87.63 40.64,87.63 39.37,86.36 39.37,82.55 v35.56,78.74
N$9
  Top 0.406: E6.5 72.39,86.36 71.12,87.63 71.12,107.95 72.39,109.22 E2.5
N$10
  Top 0.406: E6.2 74.93,93.98 77.47,96.52 77.47,105.41 78.74,106.68 E2.9
N$11
  Top 0.406: E3.5 57.15,109.22 55.88,107.95 55.88,102.87 62.23,96.52 62.23,83.82 E7.8
N$12
  Top 0.406: E3.9 64.77,106.68 63.5,105.41 63.5,92.71 64.77,91.44 E7.12
N$13
  Top 0.406: E7.6 57.15,83.82 54.61,86.36 54.61,95.25 53.34,97.79 49.53,100.33 43.18,101.6 40.64,104.14 40.64,107.95 41.91,109.22 E4.5
N$14
  Top 0.406: E7.2 57.15,93.98 55.88,95.25 54.61,99.06 53.34,105.41 52.07,106.68 E4.9
N$15
  Top 0.406: E15.9 E15.10 77.47,20.32 77.47,29.21 E11.8 77.47,38.1 77.47,44.45 74.93,46.99 E11.2
  Bottom 0.406: E16.5 60.96,16.51 63.5,15.24 76.2,15.24 78.74,16.51 E15.10
N$16  (via drill 0.81)
  other vias: 20.32,124.46
N$17  (via drill 0.81)
  other vias: 12.7,124.46
N$18  (via drill 0.81)
  other vias: 12.7,119.38
N$19  (via drill 0.81)
  other vias: 12.7,116.84
N$20  (via drill 0.81)
  other vias: 12.7,114.3
N$21  (via drill 0.81)
  other vias: 12.7,111.76
N$23
  Top 0.406: E16.9 64.77,13.97 63.5,12.7 63.5,6.35 64.77,5.08 68.58,5.08 71.12,7.62 71.12,15.24 72.39,16.51 E15.5 E15.4 76.2,21.59 76.2,35.56 E11.5
  Bottom 0.406: E11.12 76.2,45.72 72.39,45.72 71.12,44.45 71.12,40.64 72.39,39.37 E11.5
N$24
  Bottom 0.406: E18.9 36.83,13.97 40.64,12.7 60.96,12.7 63.5,11.43 E16.8
N$25
  Bottom 0.406: E18.10 36.83,16.51 40.64,15.24 53.34,15.24 55.88,13.97 E16.6
N$26
  Top 0.406: E13.5 E13.4 41.91,41.91 40.64,43.18 40.64,45.72 41.91,46.99 E13.2 E13.1
  Bottom 0.406: E18.3 29.21,22.86 30.48,25.4 30.48,29.21 33.02,34.29 33.02,36.83 34.29,38.1 36.83,38.1 39.37,39.37 E13.5
N$27
  Top 0.406: E16.13 E16.12 62.23,21.59 59.69,20.32 57.15,20.32 55.88,21.59 55.88,29.21 54.61,30.48 54.61,35.56 55.88,36.83 E12.6
N$28
  Top 0.406: E16.3 57.15,22.86 57.15,25.4 59.69,25.4 60.96,26.67 60.96,31.75 63.5,34.29 63.5,36.83 E12.10
N$29  (via drill 0.81)
  Top 0.406: R2.1 v27.94,8.89 | E18.11 36.83,19.05 38.1,17.78 38.1,10.16 36.83,8.89 v35.56,8.89
  Bottom 0.406: C23.2 R2.1 | v27.94,8.89 v35.56,8.89
N$30
  Top 0.406: D1.C 11.43,44.45 10.16,43.18 10.16,15.24 11.43,13.97 C23.1 | E13.10 49.53,39.37 48.26,40.64 48.26,43.18 49.53,44.45 E13.12
  Bottom 0.406: D1.C R3.2 22.86,43.18 45.72,43.18 48.26,44.45 E13.12
N$31
  Top 0.406: E13.13 49.53,46.99 46.99,44.45 46.99,36.83 | 46.99,36.83 46.99,35.56 44.45,33.02 41.91,33.02 39.37,38.1 39.37,41.91 38.1,43.18 38.1,44.45 36.83,45.72 34.29,45.72 33.02,46.99 34.29,48.26 36.83,48.26 36.83,60.96 33.02,66.04 33.02,76.2 34.29,77.47 36.83,77.47 36.83,80.01 34.29,80.01 31.75,82.55 31.75,93.98 29.21,96.52 E9.1 | 46.99,36.83 E13.9
  Bottom 0.406: E9.1 R4.1
N$32
  Top 0.406: E17.9 E17.10
  Bottom 0.406: E17.6 E17.9
N$33
  Top 0.406: E17.2 E17.1 39.37,34.29 38.1,38.1 38.1,41.91 E14.12
N$34
  Bottom 0.406: E18.6 25.4,13.97 24.13,15.24 24.13,17.78 21.59,22.86 17.78,22.86 16.51,24.13 16.51,27.94 21.59,33.02 24.13,36.83 26.67,39.37 E14.5
N$37  (via drill 0.81)
  other vias: 5.08,83.82
N$38  (via drill 0.81)
  other vias: 5.08,88.9
N$39  (via drill 0.81)
  other vias: 5.08,91.44
N$40  (via drill 0.81)
  other vias: 5.08,96.52
N$45  (via drill 0.81)
  other vias: 5.08,93.98
N$51  (via drill 0.81)
  other vias: 5.08,86.36
N$52  (via drill 0.81)
  other vias: 12.7,76.2
N$53  (via drill 0.81)
  other vias: 58.42,121.92
N$55  (via drill 0.81)
  other vias: 43.18,121.92
N$56  (via drill 0.81)
  other vias: 12.7,86.36
N$57  (via drill 0.81)
  other vias: 12.7,83.82
N$58  (via drill 0.81)
  other vias: 34.29,121.92
N$61  (via drill 0.81)
  other vias: 12.7,121.92
N$62  (via drill 0.81)
  other vias: 12.7,78.74
N$63  (via drill 0.81)
  other vias: 12.7,106.68
N$64  (via drill 0.81)
  other vias: 20.32,106.68
N$67  (via drill 0.81)
  other vias: 20.32,114.3
N$68  (via drill 0.81)
  other vias: 20.32,116.84
N$69  (via drill 0.81)
  other vias: 20.32,119.38
N$77  (via drill 0.81)
  other vias: 88.9,78.74
N$78  (via drill 0.81)
  other vias: 81.28,78.74
N$82  (via drill 0.81)
  other vias: 96.52,76.2
N$93  (via drill 0.81)
  other vias: 20.32,26.67
N$96  (via drill 0.81)
  other vias: 20.32,96.52
N$98  (via drill 0.81)
  other vias: 12.7,11.43
N$100  (via drill 0.81)
  other vias: 88.9,26.67
N$101  (via drill 0.81)
  other vias: 12.7,19.05
N$102  (via drill 0.81)
  other vias: 12.7,21.59
N$103  (via drill 0.81)
  other vias: 12.7,24.13
N$105  (via drill 0.81)
  other vias: 88.9,6.35
N$106  (via drill 0.81)
  other vias: 12.7,36.83
N$107  (via drill 0.81)
  other vias: 96.52,6.35
N$110  (via drill 0.81)
  other vias: 50.8,78.74
N$115  (via drill 0.81)
  other vias: 12.7,96.52
N$117  (via drill 0.81)
  other vias: 12.7,91.44
N$118  (via drill 0.81)
  other vias: 12.7,93.98
N$121  (via drill 0.81)
  other vias: 20.32,88.9
N$122  (via drill 0.81)
  other vias: 20.32,86.36
N$125  (via drill 0.81)
  other vias: 12.7,81.28
N$127  (via drill 0.81)
  other vias: 20.32,11.43
N$129  (via drill 0.81)
  other vias: 20.32,13.97
N$133  (via drill 0.81)
  other vias: 20.32,24.13
N$135  (via drill 0.81)
  other vias: 20.32,39.37
N$136  (via drill 0.81)
  other vias: 12.7,39.37
N$137  (via drill 0.81)
  other vias: 12.7,54.61
N$143  (via drill 0.81)
  other vias: 20.32,41.91
N$144  (via drill 0.81)
  other vias: 88.9,52.07
N$170  (via drill 0.81)
  other vias: 50.8,8.89
N$183  (via drill 0.81)
  other vias: 104.14,24.13
N$194  (via drill 0.81)
  other vias: 73.66,52.07
N$198  (via drill 0.81)
  other vias: 27.94,52.07
N$200  (via drill 0.81)
  other vias: 5.08,8.89
N$201  (via drill 0.81)
  other vias: 5.08,11.43
N$202  (via drill 0.81)
  other vias: 5.08,13.97
N$203  (via drill 0.81)
  other vias: 5.08,16.51
N$204  (via drill 0.81)
  other vias: 5.08,19.05
N$205  (via drill 0.81)
  other vias: 5.08,21.59
N$206  (via drill 0.81)
  other vias: 5.08,24.13
N$207  (via drill 0.81)
  other vias: 5.08,26.67
N$208  (via drill 0.81)
  other vias: 5.08,34.29
N$209  (via drill 0.81)
  other vias: 5.08,36.83
N$210  (via drill 0.81)
  other vias: 5.08,39.37
N$211  (via drill 0.81)
  other vias: 5.08,52.07
N$212  (via drill 0.81)
  other vias: 5.08,49.53
N$214  (via drill 0.81)
  other vias: 12.7,49.53
N$217  (via drill 0.81)
  other vias: 12.7,41.91
N$218  (via drill 0.81)
  other vias: 5.08,46.99
N$219  (via drill 0.81)
  other vias: 5.08,44.45
N$220  (via drill 0.81)
  other vias: 5.08,41.91
N$221  (via drill 0.81)
  other vias: 5.08,78.74
N$222  (via drill 0.81)
  other vias: 5.08,81.28
N$223  (via drill 0.81)
  other vias: 43.18,52.07
N$226  (via drill 0.81)
  other vias: 5.08,121.92
N$227  (via drill 0.81)
  other vias: 5.08,119.38
N$228  (via drill 0.81)
  other vias: 5.08,116.84
N$229  (via drill 0.81)
  other vias: 5.08,114.3
N$230  (via drill 0.81)
  other vias: 5.08,111.76
N$231  (via drill 0.81)
  other vias: 5.08,109.22
N$232  (via drill 0.81)
  other vias: 5.08,106.68
N$233  (via drill 0.81)
  other vias: 5.08,104.14
N$240  (via drill 0.81)
  other vias: 73.66,8.89
N$241  (via drill 0.81)
  other vias: 81.28,8.89
PWR  (via drill 0.81)
  Bottom 0.406: U$5.BR2 116.84,16.51 111.76,16.51 109.22,15.24 102.87,15.24 99.06,13.97 v96.52,13.97 v88.9,13.97 87.63,13.97 83.82,17.78 72.39,17.78 E16.11
RD_HOLE_1  (via drill 0.81)
  Bottom 0.406: U$5.AD2 116.84,118.11 102.87,118.11 99.06,121.92 v96.52,121.92 95.25,121.92 91.44,123.19 86.36,123.19 83.82,121.92 v81.28,121.92 78.74,121.92 76.2,123.19 69.85,123.19 67.31,120.65 63.5,120.65 60.96,118.11 55.88,118.11 52.07,114.3 E4.12
RD_HOLE_2  (via drill 0.81)
  Top 0.406: U$5.AD1 115.57,118.11 110.49,118.11 106.68,119.38 v104.14,119.38
  Bottom 0.406: v104.14,119.38 100.33,123.19 95.25,123.19 91.44,125.73 86.36,125.73 82.55,123.19 80.01,123.19 76.2,125.73 69.85,125.73 67.31,123.19 55.88,123.19 52.07,120.65 48.26,120.65 E4.2
RD_HOLE_3
  Bottom 0.406: U$5.AE2 116.84,115.57 102.87,115.57 99.06,118.11 95.25,118.11 91.44,120.65 87.63,120.65 82.55,118.11 80.01,118.11 76.2,120.65 72.39,120.65 71.12,119.38 69.85,116.84 67.31,114.3 E3.12
RD_HOLE_4  (via drill 0.81)
  Top 0.406: U$5.AE1 116.84,115.57 110.49,115.57 106.68,116.84 v104.14,116.84
  Bottom 0.406: E3.2 60.96,116.84 63.5,118.11 67.31,118.11 71.12,121.92 v73.66,121.92 76.2,121.92 78.74,120.65 83.82,120.65 86.36,121.92 v88.9,121.92 91.44,121.92 95.25,120.65 99.06,120.65 102.87,116.84 v104.14,116.84
RD_HOLE_5
  Bottom 0.406: U$5.AH2 115.57,109.22 110.49,109.22 109.22,107.95 102.87,107.95 99.06,110.49 95.25,110.49 91.44,113.03 87.63,113.03 85.09,114.3 E2.12
RD_HOLE_6  (via drill 0.81)
  Top 0.406: U$5.AH1 116.84,109.22 110.49,109.22 106.68,111.76 v104.14,111.76
  Bottom 0.406: E2.2 76.2,116.84 78.74,115.57 91.44,115.57 95.25,113.03 99.06,113.03 102.87,111.76 v104.14,111.76
RD_HOLE_7
  Bottom 0.406: U$5.AF2 116.84,111.76 110.49,111.76 109.22,113.03 102.87,113.03 99.06,114.3 E1.12
RD_HOLE_8  (via drill 0.81)
  Top 0.406: U$5.AF1 116.84,111.76 110.49,111.76 106.68,114.3 v104.14,114.3
  Bottom 0.406: E1.2 92.71,116.84 95.25,115.57 99.06,115.57 102.87,114.3 v104.14,114.3
RDR_FLAG  (via drill 0.81)
  Top 0.406: E9.8 E9.9 36.83,83.82 38.1,85.09 38.1,87.63 36.83,88.9 E9.11 | v20.32,109.22 v12.7,109.22 10.16,109.22 8.89,107.95 8.89,87.63 11.43,85.09 19.05,85.09 v20.32,83.82
  Bottom 0.406: E9.9 30.48,85.09 24.13,85.09 v20.32,83.82 | v20.32,109.22 E5.5
RDR_RUN
  Bottom 0.406: E5.2 29.21,116.84 30.48,115.57 30.48,109.22 33.02,106.68 E5.9
RFC_DELAYED  (via drill 0.81)
  Top 0.406: E4.1 40.64,119.38 39.37,118.11 39.37,115.57 36.83,113.03 33.02,113.03 31.75,111.76 31.75,109.22 | 31.75,109.22 E5.10 | E3.1 55.88,119.38 52.07,116.84 E4.13 49.53,116.84 48.26,118.11 48.26,120.65 49.53,121.92 v50.8,121.92 | E2.13 82.55,116.84 86.36,119.38 E1.1 | 24.13,46.99 E14.2 | 24.13,46.99 25.4,53.34 25.4,99.06 30.48,101.6 31.75,102.87 31.75,109.22 | 24.13,46.99 24.13,34.29 E18.13 | E3.13 64.77,116.84 63.5,118.11 63.5,120.65 64.77,121.92 v66.04,121.92
  Bottom 0.406: E14.2 30.48,48.26 53.34,48.26 54.61,46.99 54.61,36.83 52.07,34.29 E13.8 | E4.13 52.07,116.84 54.61,119.38 E3.1 62.23,121.92 v66.04,121.92 | E3.13 64.77,116.84 63.5,115.57 63.5,114.3 64.77,113.03 67.31,113.03 71.12,116.84 72.39,119.38 E2.1 76.2,119.38 80.01,116.84 E2.13 82.55,116.84 87.63,119.38 E1.1 91.44,119.38 95.25,116.84 E1.13 | E4.1 46.99,121.92 v50.8,121.92
SHIFT  (via drill 0.81)
  Top 0.406: U$5.BJ1 116.84,35.56 110.49,35.56 106.68,36.83 v104.14,36.83
  Bottom 0.406: v104.14,36.83 101.6,36.83 99.06,35.56 95.25,35.56 91.44,38.1 87.63,38.1 83.82,41.91 E11.11 78.74,41.91 76.2,44.45 E11.3
SKIP
  Bottom 0.406: U$5.AK2 116.84,102.87 93.98,102.87 90.17,100.81 77.47,100.81 73.66,100.33 41.91,100.33 38.1,96.52 38.1,95.25 36.83,93.98 E9.13
STOP_COMPLETE
  Top 0.406: E16.1 55.88,31.75 55.88,34.29 57.15,35.56 59.69,35.56 60.96,36.83 60.96,41.91 E12.3
  Bottom 0.406: U$5.BN2 116.84,22.86 111.76,22.86 107.95,25.4 95.25,25.4 90.17,27.94 86.36,27.94 83.82,29.05 64.77,29.05 60.96,26.67 E16.1
VCC  (via drill 0.81)
  Top 0.813: R4.2 v20.32,78.74 v20.32,76.2 v20.32,54.61 v12.7,52.07 8.89,52.07 7.62,50.8 7.62,10.16 8.89,8.89 v12.7,8.89 | C15.1 83.82,8.89 83.82,24.13 E15.14 85.09,31.75 85.09,46.99 82.55,49.53 | C11.1 82.55,54.61 83.82,53.34 83.82,50.8 82.55,49.53 | 82.55,49.53 E11.14 | 97.79,49.53 E10.14 | 97.79,49.53 99.06,50.8 99.06,53.34 97.79,54.61 C10.1 | 97.79,49.53 99.06,48.26 99.06,22.86 97.79,21.59 v96.52,21.59 | E12.14 67.31,49.53 68.58,50.8 68.58,53.34 67.31,54.61 C12.1 | E13.14 52.07,49.53 53.34,50.8 53.34,53.34 52.07,54.61 C13.1 C8.1 52.07,76.2 53.34,77.47 53.34,95.25 52.07,96.52 E8.14 | C1.1 97.79,124.46 99.06,123.19 99.06,120.65 97.79,119.38 E1.14 | C5.1 35.56,124.46 36.83,123.19 36.83,120.65 35.56,119.38 E5.14 | E4.14 52.07,119.38 53.34,120.65 53.34,123.19 52.07,124.46 C4.1 | 67.31,119.38 E3.14 | 67.31,119.38 68.58,120.65 68.58,123.19 67.31,124.46 C3.1 | E2.14 82.55,119.38 83.82,120.65 83.82,123.19 82.55,124.46 C2.1 | v96.52,96.52 104.14,96.52 C20.1 | C9.1 38.1,76.2 39.37,77.47 39.37,95.25 38.1,96.52 E9.14 | C7.1 67.31,76.2 69.85,78.74 69.85,93.98 67.31,96.52 E7.14 68.58,102.87 68.58,118.11 67.31,119.38 | C16.1 67.31,6.35 69.85,8.89 69.85,25.4 68.58,26.67 E16.14 | C14.1 34.29,54.61 33.02,53.34 33.02,50.8 34.29,49.53 E14.14 | E6.14 80.01,96.52 78.74,95.25 78.74,77.47 80.01,76.2 C6.1 | E17.14 49.53,26.67 48.26,25.4 48.26,7.62 49.53,6.35 C17.1
  Bottom 0.813: 15.24,16.51 R1.2 | 15.24,16.51 R2.2 | 15.24,8.89 15.24,16.51 | U$5.BA2 116.84,58.42 111.76,58.42 104.14,54.61 | 104.14,54.61 C21.1 | U$5.AA2 116.84,128.27 111.76,128.27 106.68,124.46 104.14,124.46 C19.1 C1.1 91.44,127 86.36,127 C2.1 76.2,127 69.85,127 C3.1 60.96,127 55.88,127 C4.1 45.72,127 40.64,127 C5.1 33.02,124.46 27.94,121.92 v26.67,121.92 v20.32,121.92 19.05,121.92 17.78,120.65 17.78,80.01 19.05,78.74 v20.32,78.74 v27.94,78.74 29.21,78.74 33.02,76.2 C9.1 36.83,76.2 40.64,78.74 v43.18,78.74 45.72,78.74 49.53,76.2 C8.1 52.07,76.2 55.88,78.74 v58.42,78.74 60.96,78.74 64.77,76.2 C7.1 67.31,76.2 71.12,78.74 v73.66,78.74 76.2,78.74 78.74,76.2 C6.1 | v12.7,8.89 15.24,8.89 | 15.24,8.89 v20.32,8.89 21.59,8.89 26.67,3.81 29.21,3.81 33.02,6.35 C18.1 36.83,6.35 40.64,3.81 44.45,3.81 48.26,6.35 C17.1 52.07,6.35 55.88,3.81 59.69,3.81 63.5,6.35 C16.1 67.31,6.35 72.39,3.81 74.93,3.81 78.74,6.35 C15.1 | 104.14,54.61 C10.1 92.71,57.15 86.36,57.15 C11.1 76.2,57.15 71.12,57.15 C12.1 60.96,57.15 55.88,57.15 C13.1 44.45,57.15 40.64,57.15 C14.1 29.21,57.15 25.4,57.15 v20.32,54.61 | C22.1 104.14,21.59 v96.52,21.59 95.25,21.59 90.17,24.13 v88.9,24.13 86.36,24.13 83.82,26.67 E15.14 | E18.14 38.1,26.67 41.91,29.21 44.45,29.21 48.26,26.67 E17.14 | v96.52,96.52 v88.9,96.52 E6.14

### Text on the board
Top: DEC
Bottom: READER CONTROL M705D